# EAGLE design KoppRobotRevC (EAGLE 6.4)
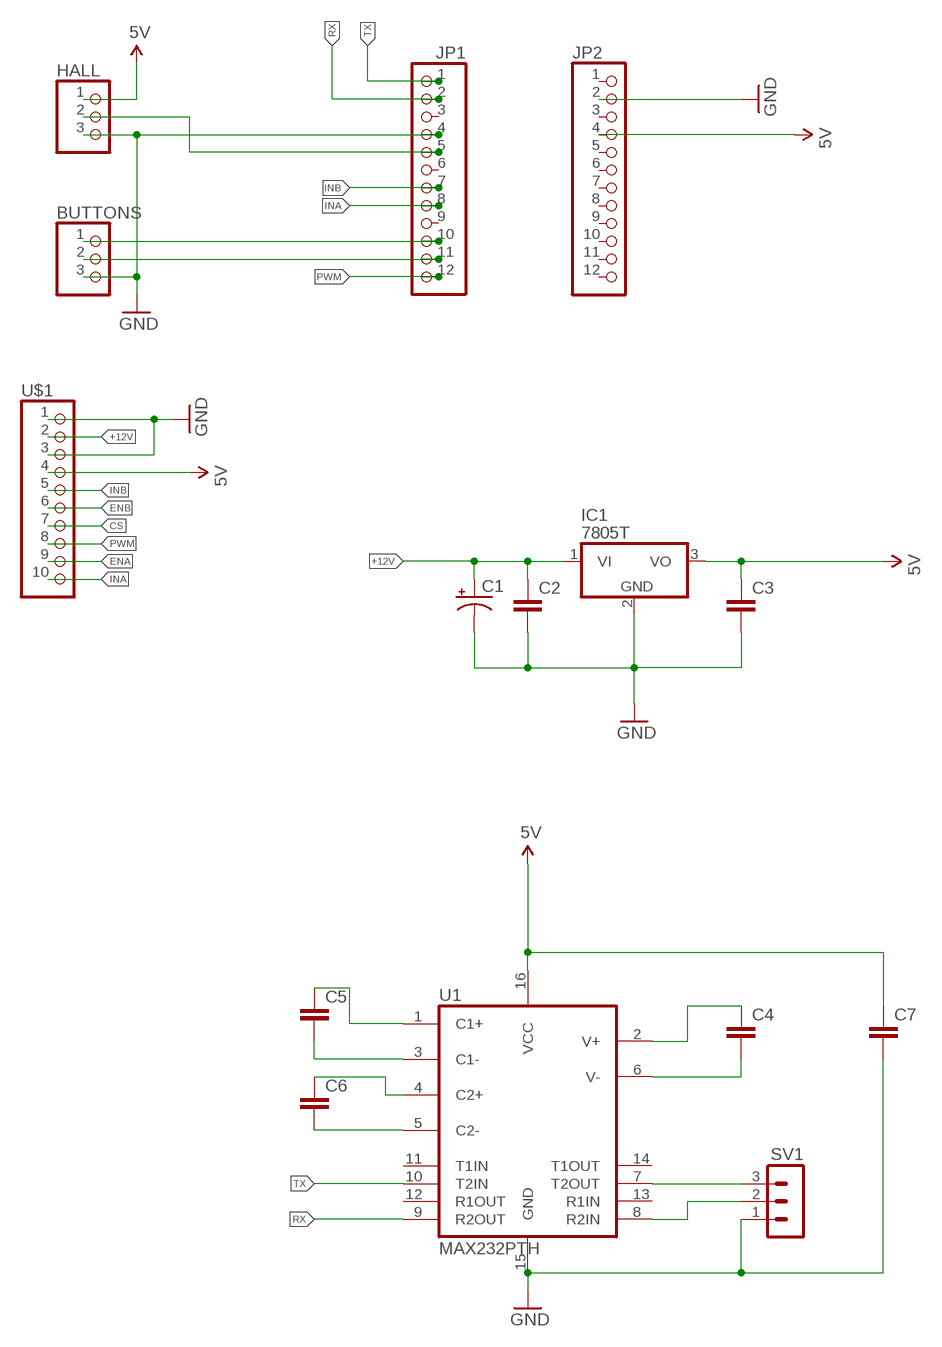
[diagram p0: schematic, sheet 1]

## Parts
BUTTONS  PINHD-1X3  [1X03]
C1  CAP_POLPTH3  [CPOL-RADIAL-1000UF-63V]
C2  CAP0603-CAP  [0603-CAP]
C3  CAP0603-CAP  [0603-CAP]
C4  CAP0603-CAP  [0603-CAP]
C5  CAP0603-CAP  [0603-CAP]
C6  CAP0603-CAP  [0603-CAP]
C7  CAP0603-CAP  [0603-CAP]
HALL  PINHD-1X3  [1X03]
IC1  7805T  [TO220H]
JP1  PINHD-1X12  [1X12]
JP2  PINHD-1X12  [1X12]
SV1  MA03-1  [MA03-1]
U1  MAX232PTH  [DIL16]
U$1  PINHD-1X10  [1X10]

## Nets
5V: C3.1 C7.1 HALL.1 IC1.3(VO) JP2.4 U1.16(VCC) U$1.4
+12V: C1.1(+) C2.1 IC1.1(VI) U$1.2
CS: U$1.7
ENA: U$1.9
ENB: U$1.6
GND: BUTTONS.3 C1.2(-) C2.2 C3.2 C7.2 HALL.3 IC1.2(GND) JP1.4 JP2.2 SV1.1 U1.15(GND) U$1.1 U$1.3
INA: JP1.8 U$1.10
INB: JP1.7 U$1.5
N$2: C5.1 U1.1(C1+)
N$3: C5.2 U1.3(C1-)
N$4: C6.1 U1.4(C2+)
N$5: C6.2 U1.5(C2-)
N$6: C4.2 U1.6(V-)
N$7: C4.1 U1.2(V+)
N$8: SV1.2 U1.8(R2IN)
N$9: SV1.3 U1.7(T2OUT)
N$10: BUTTONS.2 JP1.11
N$11: BUTTONS.1 JP1.10
N$13: HALL.2 JP1.5
PWM: JP1.12 U$1.8
RX: JP1.2 U1.9(R2OUT)
TX: JP1.1 U1.10(T2IN)
Unconnected: JP1.3 JP1.6 JP1.9 JP2.1 JP2.3 JP2.5 JP2.6 JP2.7 JP2.8 JP2.9 JP2.10 JP2.11 JP2.12 U1.11(T1IN) U1.12(R1OUT) U1.13(R1IN) U1.14(T1OUT)

## Library data of the parts
BUTTONS HALL = pinhead:PINHD-1X3: PIN HEADER
C1 = SparkFun-Capacitors:CAP_POL: Capacitor Polarized These are standard SMD and PTH capacitors. Normally 10uF, 47uF, and 100uF in electrolytic and tantalum varieties. Always verify the external diameter of the through hole cap, it varies with capacity, voltage, and manufacturer. The EIA devices should be standard.
C2-C7 = SparkFun-Capacitors:CAP: Capacitor Standard 0603 ceramic capacitor, and 0.1" leaded capacitor.
IC1 = adafruit:78*: Positive VOLTAGE REGULATOR Added bigger pads to the TO-92 package
JP1 JP2 = pinhead:PINHD-1X12: PIN HEADER
SV1 = con-lstb:MA03-1: PIN HEADER; OC_FARNELL: unknown; OC_NEWARK: unknown
U1 = SparkFun-DigitalIC:MAX232: RS232 Transceiver Very common IC. This is generically called 'MAX232', but works with the 3V equivalent MAX3232 generic ICs. Field tested and mother approved. Spark Fun Electronics SKU : COM-00316 (DIP) and COM-00589 (SMD)
U$1 = pinhead:PINHD-1X10: PIN HEADER

## Net classes
0 default: width 0.508 mm, drill 0.508 mm, clearance 0.762 mm

## Board
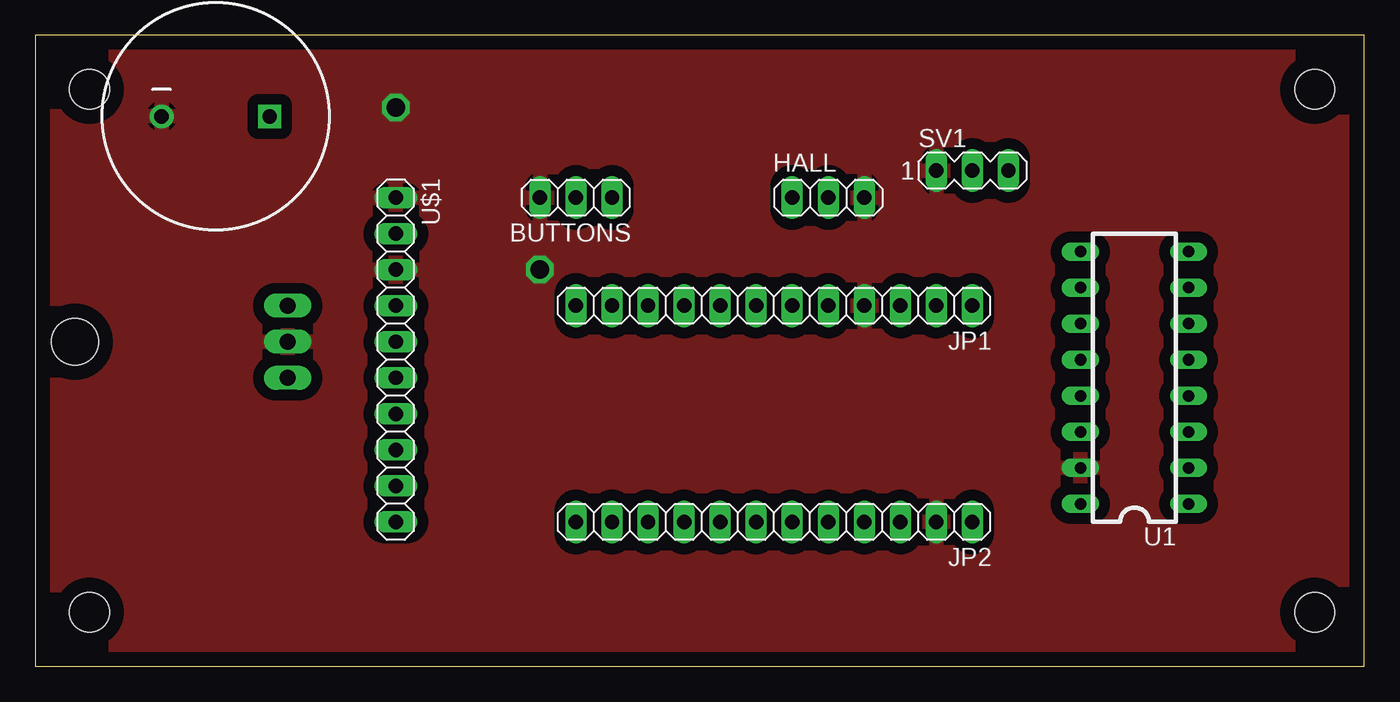
[diagram p1: board, top side]
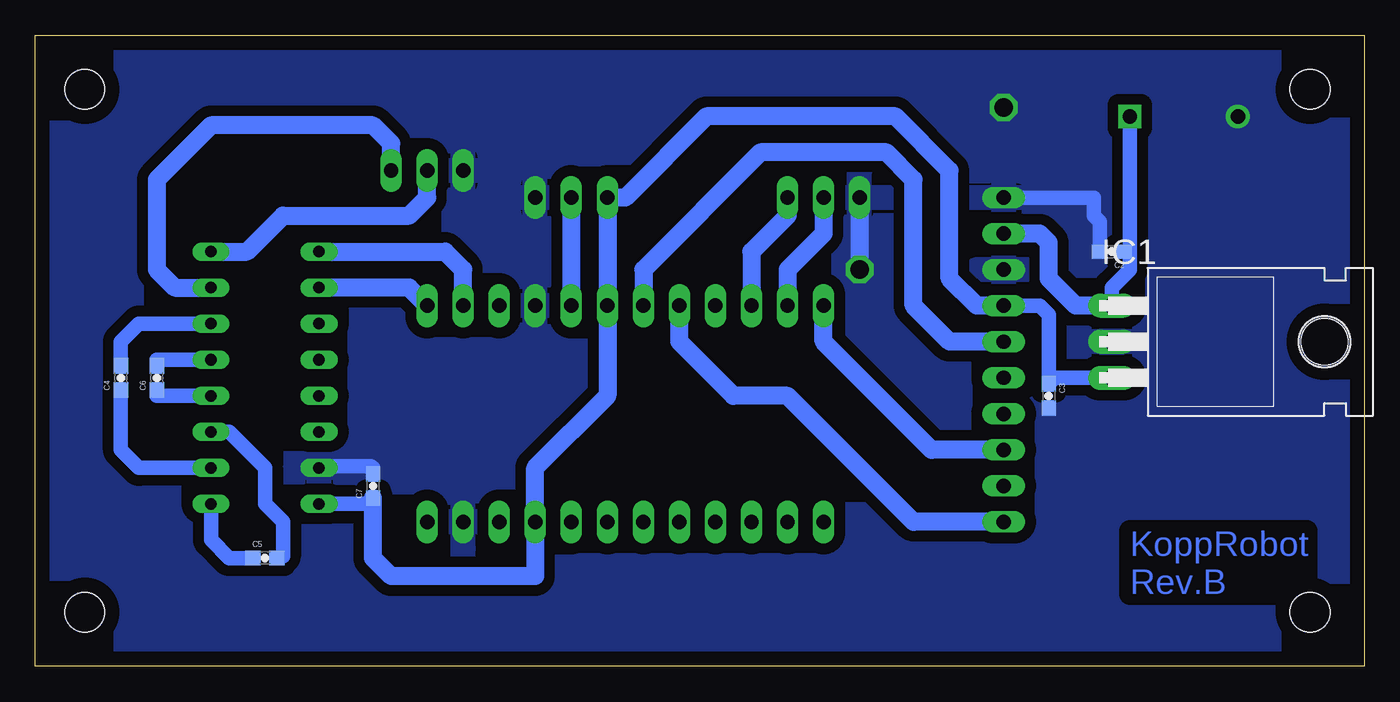
[diagram p2: board, bottom side, seen from below]

Size 93.65 x 44.44 mm. Coordinates in mm from the lower left corner, seen from the top.
Outline: 0,0 93.65,0 93.65,44.44 0,44.44 0,0
Copper layers (1*16): Top 0.035mm / dielectric 1.5mm / Bottom 0.035mm
Design rules "default": minimum track width 10mil, minimum drill 24mil, track to track 8mil, track to pad 8mil, pad to pad 8mil, via to via 8mil, smd to smd 8mil, copper to edge 40mil, drill to drill 8mil, minimum pad ring 10mil, minimum via ring 8mil, stop-mask expansion 4mil, vias tented up to drill 0mil, thermal gap 10mil
Holes 2.8 mm at 3.81,40.64 90.17,40.64 90.17,3.81 3.81,3.81

### Footprints (pad centres in the part's own frame; a part is rotated, then mirrored left to right if it is on the bottom)
1X03 = drill 1.016 long: 1 -2.54,0; 2 0,0; 3 2.54,0
CPOL-RADIAL-1000UF-63V = drill 1.016 pad 1.651 square: 1 3.81,0 | drill 1.016 pad 1.676: 2 -3.81,0
0603-CAP = smd 1.1 x 1: 1 -0.85,0; 2 0.85,0
TO220H = drill 1.118 long: 1 -2.54,-10.16; 2 0,-10.16; 3 2.54,-10.16 | hole 3.302: 0,4.826
1X12 = drill 1.016 long: 1 -13.97,0; 2 -11.43,0; 3 -8.89,0; 4 -6.35,0; 5 -3.81,0; 6 -1.27,0; 7 1.27,0; 8 3.81,0; 9 6.35,0; 10 8.89,0; 11 11.43,0; 12 13.97,0
MA03-1 = drill 1.016 long: 1 -2.54,0; 2 0,0; 3 2.54,0
DIL16 = drill 0.813 long: 1 -8.89,-3.81; 2 -6.35,-3.81; 3 -3.81,-3.81; 4 -1.27,-3.81; 5 1.27,-3.81; 6 3.81,-3.81; 7 6.35,-3.81; 8 8.89,-3.81; 9 8.89,3.81; 10 6.35,3.81; 11 3.81,3.81; 12 1.27,3.81; 13 -1.27,3.81; 14 -3.81,3.81; 15 -6.35,3.81; 16 -8.89,3.81
1X10 = drill 1.016 long: 1 -11.43,0; 2 -8.89,0; 3 -6.35,0; 4 -3.81,0; 5 -1.27,0; 6 1.27,0; 7 3.81,0; 8 6.35,0; 9 8.89,0; 10 11.43,0

### Placement (x,y rotation side)
BUTTONS  38.1,33.02 180 top
C1  12.7,38.73 0 top
C2  17.78,29.21 180 bottom
C3  22.23,19.05 270 bottom
C4  87.63,20.32 90 bottom
C5  77.47,7.62 0 bottom
C6  85.09,20.32 90 bottom
C7  69.85,12.7 90 bottom
HALL  55.88,33.02 0 top
IC1  7.62,22.86 270 bottom
JP1  52.07,25.4 180 top
JP2  52.07,10.16 180 top
SV1  66.04,34.92 0 top
U1  77.47,20.32 90 top
U$1  25.4,21.59 270 top

### Tracks (layer width: path | path; a pad name or v marks a point on that pad's centre or on a via)
5V
  Bottom 1.016: U1.16 70.27,11.43 C7.1 | IC1.3 21.8,20.32 C3.1 22.23,24.77 22.86,25.4 U$1.4
  Bottom 1.27: U$1.4 27.3,25.4 29.21,27.3 29.21,34.92 33.02,38.73 46.35,38.73 52.07,33.02 HALL.1 53.34,19.05 58.42,13.97 JP2.4 58.42,6.35 68.58,6.35 69.85,7.62 C7.1
+12V
  Bottom 1.016: C1.1 16.51,29.21 | IC1.1 17.78,26.67 16.51,27.94 16.51,29.21 | 16.51,29.21 C2.1
  Bottom 1.27: IC1.1 20.32,25.4 22.23,27.3 22.23,29.84 22.86,30.48 U$1.2
GND  (via drill 1.3)
  Bottom 1.016: U1.15 73.53,14.1 69.98,14.1 69.85,13.97 C7.2 | C2.2 18.63,31.33 19.05,31.75 19.05,33.02 U$1.1
  Bottom 1.27: BUTTONS.3 v35.56,27.94
  other vias: 25.4,39.37
  pour Bottom: -1.27,46.99 96.52,48.26 97.79,-1.27 -2.54,-1.27
  pour Top: -1.27,46.99 -1.27,0 95.25,0 95.25,6.35 95.25,45.72 95.25,46.99
INA
  Bottom 1.27: U$1.10 31.75,10.16 40.64,19.05 44.45,19.05 48.26,22.86 JP1.8
INB
  Bottom 1.27: U$1.5 29.21,22.86 31.75,25.4 31.75,34.29 33.66,36.2 42.55,36.2 50.8,27.94 JP1.7
N$2
  Bottom 1.016: C5.1 80.01,7.62 81.28,8.89 U1.1
N$3
  Bottom 1.016: U1.3 80.01,16.51 77.47,13.97 77.47,11.43 76.2,10.16 76.2,7.75 C5.2
N$4
  Bottom 1.016: U1.4 85.09,19.05 C6.1
N$5
  Bottom 1.016: U1.5 85.09,21.59 C6.2
N$6
  Bottom 1.016: U1.6 86.36,24.13 87.63,22.86 C4.2
N$7
  Bottom 1.016: U1.2 86.36,13.97 87.63,15.24 C4.1
N$8
  Bottom 1.27: U1.8 78.74,29.21 76.2,31.75 67.31,31.75 66.04,33.02 SV1.2
N$9
  Bottom 1.27: SV1.3 68.58,36.83 69.85,38.1 81.28,38.1 85.09,34.29 85.09,27.94 83.82,26.67 U1.7
N$10
  Bottom 1.27: BUTTONS.2 38.1,30.48 40.64,27.94 JP1.11
N$11
  Bottom 1.27: BUTTONS.1 40.64,31.75 43.18,29.21 JP1.10
N$13
  Bottom 1.27: HALL.2 JP1.5
PWM
  Bottom 1.27: U$1.8 30.48,15.24 38.1,22.86 JP1.12
RX
  Bottom 1.27: U1.9 64.77,29.21 63.5,27.94 JP1.2
TX
  Bottom 1.27: JP1.1 67.31,26.67 U1.10

### Text on the board
Bottom: KoppRobot / Rev.B